# EAGLE design connection_board (EAGLE 8.6.0)
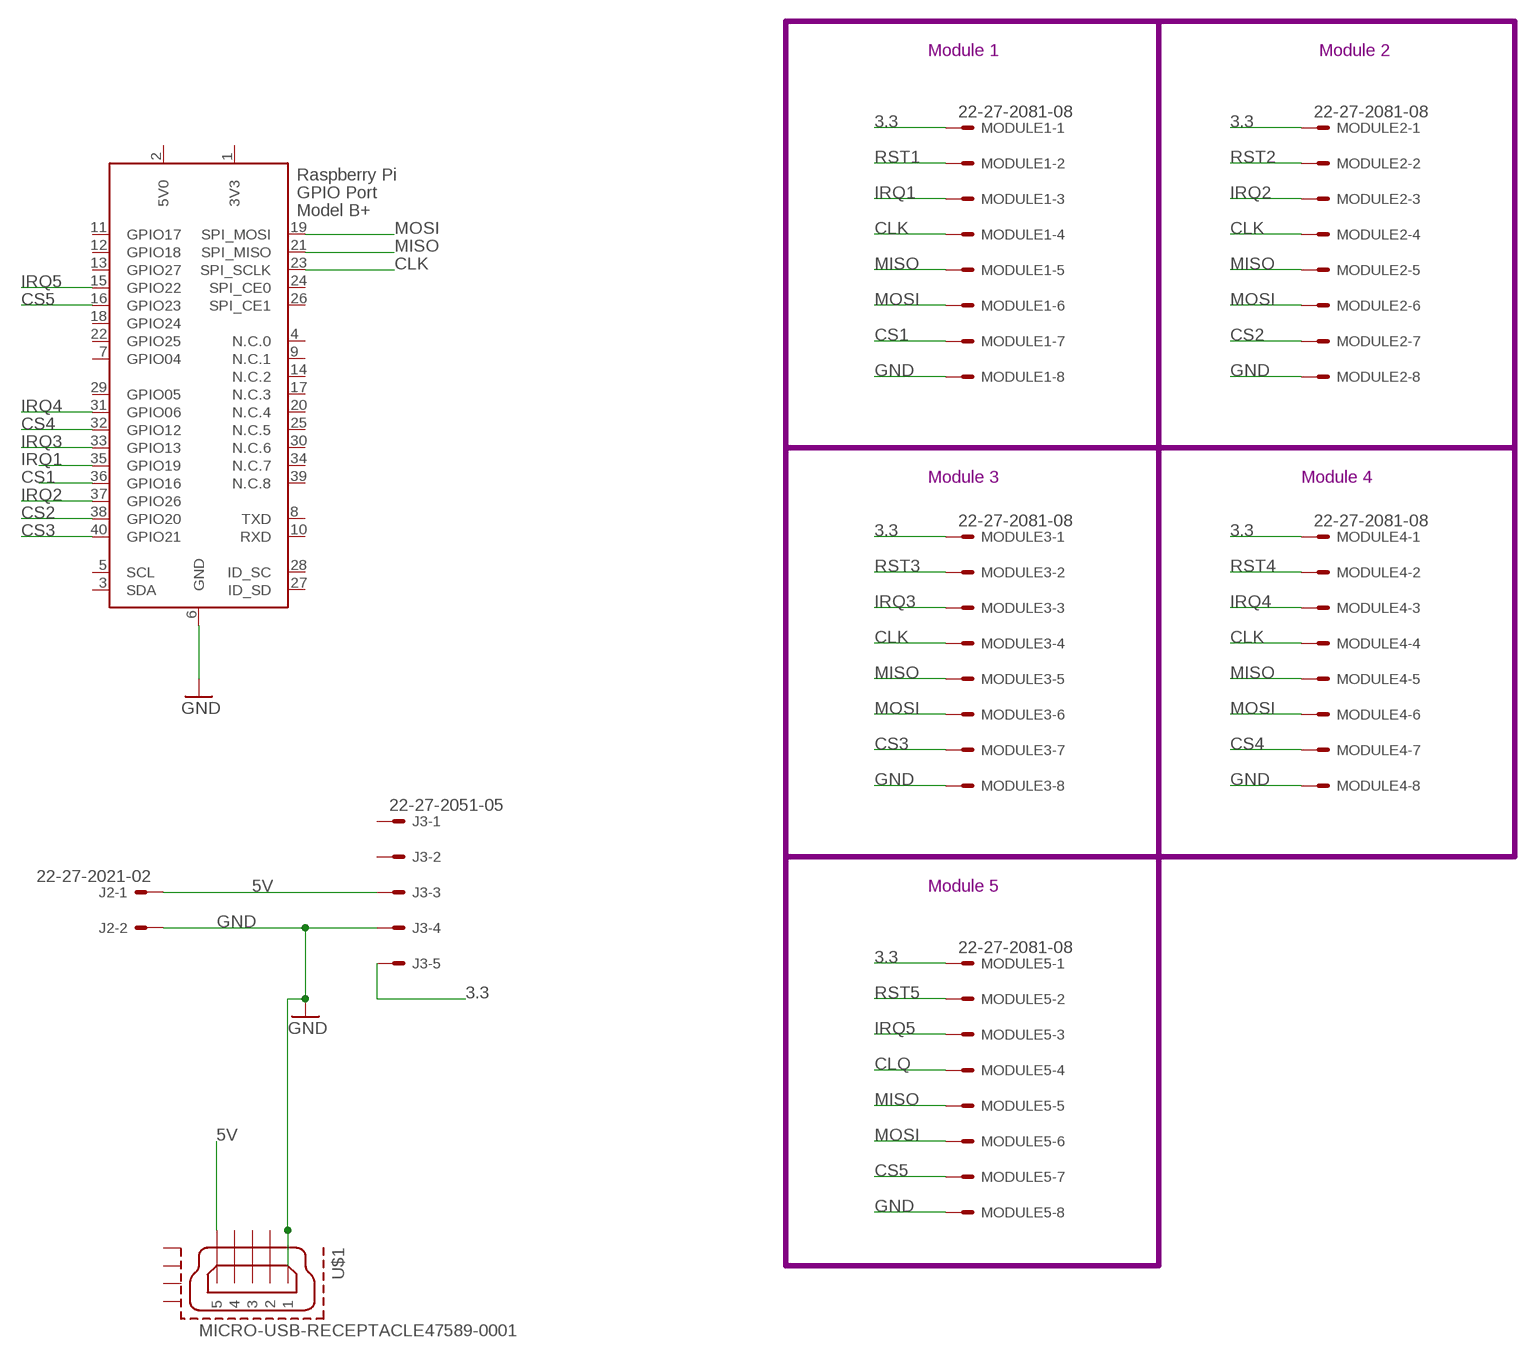
[diagram p0: schematic, sheet 1]

## Parts
J2  22-27-2021-02  [6410-02]
J3  22-27-2051-05  [6410-05]
MODULE1  22-27-2081-08  [6410-08]
MODULE2  22-27-2081-08  [6410-08]
MODULE3  22-27-2081-08  [6410-08]
MODULE4  22-27-2081-08  [6410-08]
MODULE5  22-27-2081-08  [6410-08]
U$1  MICRO-USB-RECEPTACLE47589-0001  [47589-0001]
X1  RASPI_BOARD_B+_E0  [RASPI_BOARD_B+_EDGES_0DRILL]

## Nets
3.3: J3.5 MODULE1.1 MODULE2.1 MODULE3.1 MODULE4.1 MODULE5.1
5V: J2.1 J3.3 U$1.5
CLK: MODULE1.4 MODULE2.4 MODULE3.4 MODULE4.4 X1.23(SPI_SCLK)
CLQ: MODULE5.4
CS1: MODULE1.7 X1.36(GPIO16)
CS2: MODULE2.7 X1.38(GPIO20)
CS3: MODULE3.7 X1.40(GPIO21)
CS4: MODULE4.7 X1.32(GPIO12)
CS5: MODULE5.7 X1.16(GPIO23)
GND: J2.2 J3.4 MODULE1.8 MODULE2.8 MODULE3.8 MODULE4.8 MODULE5.8 U$1.1 X1.6(GND)
IRQ1: MODULE1.3 X1.35(GPIO19)
IRQ2: MODULE2.3 X1.37(GPIO26)
IRQ3: MODULE3.3 X1.33(GPIO13)
IRQ4: MODULE4.3 X1.31(GPIO06)
IRQ5: MODULE5.3 X1.15(GPIO22)
MISO: MODULE1.5 MODULE2.5 MODULE3.5 MODULE4.5 MODULE5.5 X1.21(SPI_MISO)
MOSI: MODULE1.6 MODULE2.6 MODULE3.6 MODULE4.6 MODULE5.6 X1.19(SPI_MOSI)
RST1: MODULE1.2
RST2: MODULE2.2
RST3: MODULE3.2
RST4: MODULE4.2
RST5: MODULE5.2
Unconnected: J3.1 J3.2 U$1.2 U$1.3 U$1.4 U$1.CASING1(GND1) U$1.CASING2(GND2) U$1.CASING3(GND3) U$1.CASING4(GND4) X1.3(SDA) X1.4(N.C.0) X1.5(SCL) X1.7(GPIO04) X1.8(TXD) X1.9(N.C.1) X1.10(RXD) X1.11(GPIO17) X1.12(GPIO18) X1.13(GPIO27) X1.14(N.C.2) X1.17(N.C.3) X1.18(GPIO24) X1.20(N.C.4) X1.22(GPIO25) X1.24(SPI_CE0) X1.25(N.C.5) X1.26(SPI_CE1) X1.27(ID_SD) X1.28(ID_SC) X1.29(GPIO05) X1.30(N.C.6) X1.34(N.C.7) X1.39(N.C.8)

## Notes on the sheet
- Module 1 | Module 2
- Module 3 | Module 4
- Module 5

## Power pins joined to a net without a drawn wire
3V3: X1.1(3V3)
5V0: X1.2(5V0)

## Library data of the parts
J2 = 2pin1.15mm:22-?-02: CONNECTOR wire to board 2.54 mm (.1 inch) pitch header; MF: MOLEX; OC_FARNELL: unknown; OC_NEWARK: unknown
J3 = pin51.1mm:22-?-05: CONNECTOR wire to board 2.54 mm (.1 inch) pitch header; MF: MOLEX; OC_FARNELL: unknown; OC_NEWARK: unknown
MODULE1-MODULE5 = 8pin1.15mm:22-?-08: CONNECTOR wire to board 2.54 mm (.1 inch) pitch header; MF: MOLEX; OC_FARNELL: unknown; OC_NEWARK: unknown
U$1 = con-molex-usb:MICRO-USB-RECEPTACLE: MICRO USB RECEPTACLES Micro-USB Receptacles, SMT, Lead-Free from MOLEX <http://www.molex.com/>. (C) 2014 Tomasz Boleslaw CEDRO, cederom@tlen.pl, http://www.tomek.cedro.info. Version 0.1 (2014-01-17): Initial release. Version 0.2 (2014-02-06): Updated 47589-0001 footprint pins/pads/milling. Following devices are included: 1. 47589-0001 Micro-USB AB Receptacle, Bottom Mount, SMT, Lead-Free <http://www.molex.com/molex/products/datasheet.jsp?part=active/0475890001_IO_CONNECTORS.xml> (Technical Drawing <http://www.molex.com/pdm_docs/sd/475890001_sd.pdf>).
X1 = raspberrypi_bastelstube_v13:RASPI_BOARD_B+: Raspberry Pi GPIO connector with markings for the outer dimensions of the Raspberry Pi board model B+ with different sets of drill holes or mounting pads

## Board
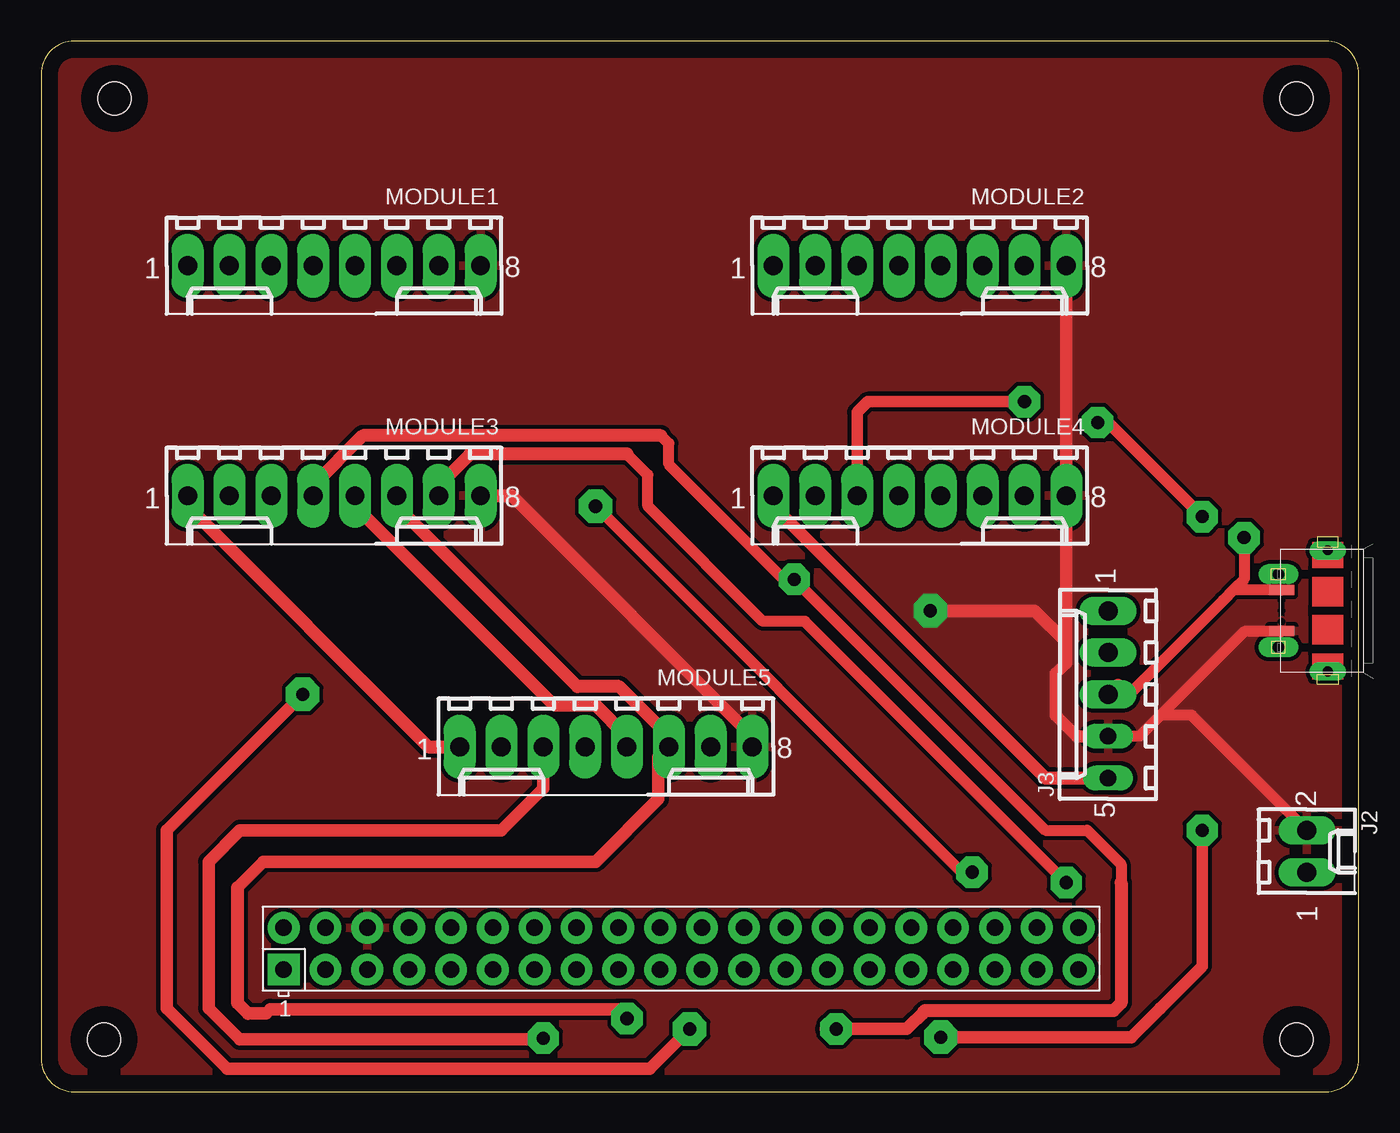
[diagram p1: board, top side]
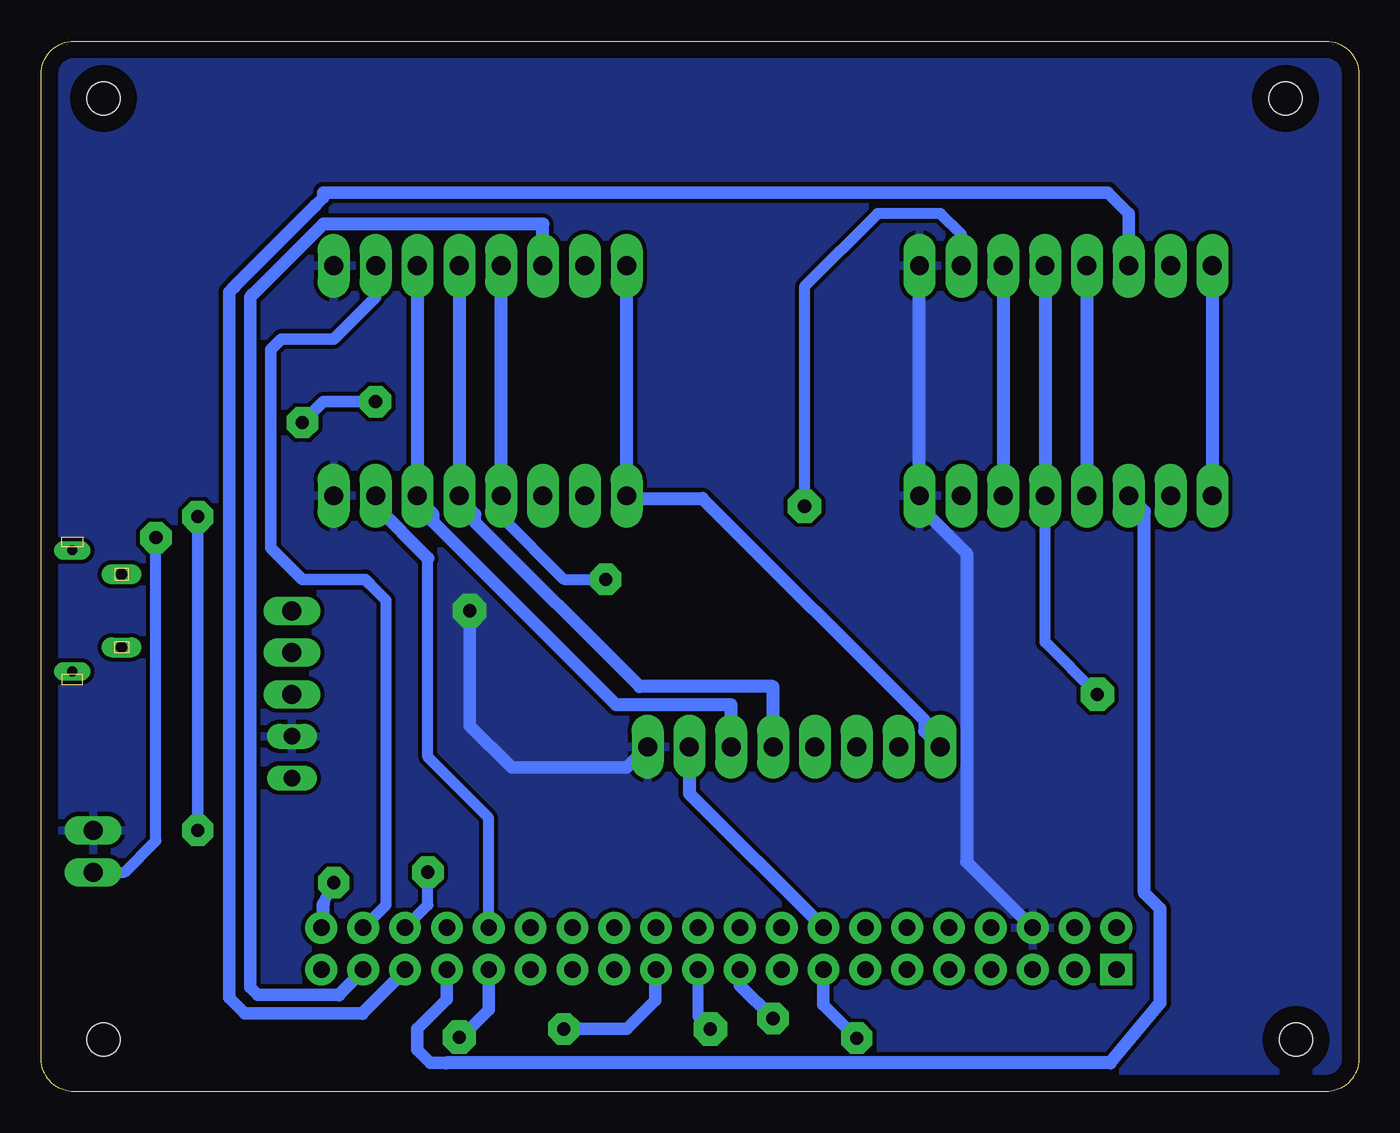
[diagram p2: board, bottom side, seen from below]

Size 79.99 x 63.8 mm. Coordinates in mm from the lower left corner, seen from the top.
Outline: 0,61.8 0,2 arc90 2,0 77.99,0 arc90 79.99,2 79.99,61.8 arc90 77.99,63.8 2,63.8 arc90 0,61.8
Copper layers (1*16): Top 0.035mm / dielectric 1.5mm / Bottom 0.035mm
Design rules "default *": minimum track width 0.8mm, minimum drill 0.8mm, track to track 0.25mm, track to pad 6mil, pad to pad 6mil, via to via 6mil, smd to smd 6mil, copper to edge 40mil, drill to drill 6mil, minimum pad ring 10mil, minimum via ring 8mil, stop-mask expansion 4mil, vias tented up to drill 0mil, thermal gap 10mil
Holes 2 mm at 3.81,3.17 76.2,3.17 76.2,60.32 4.45,60.32

### Footprints (pad centres in the part's own frame; a part is rotated, then mirrored left to right if it is on the bottom)
6410-02 = drill 1.15 long: 1 1.27,0; 2 -1.27,0
6410-05 = drill 1.15 long: 1 5.08,0; 2 2.54,0; 3 0,0 | drill 1.016 long: 4 -2.54,0; 5 -5.08,0
6410-08 = drill 1.15 pad 1.93 long: 1 8.89,0; 2 6.35,0; 3 3.81,0; 4 1.27,0; 5 -1.27,0; 6 -3.81,0; 7 -6.35,0; 8 -8.89,0
47589-0001 = smd 1.524 x 0.61: 1 2.8,1.224; 5 2.8,-1.249 | smd 0 x 0: 2 2.8,0.65; 3 2.8,0; 4 2.8,-0.65 | drill 0.6 pad 0.95 long: CASING1 0,3.675; CASING2 0,-3.675 | drill 0.7 pad 0.889 long: CASING3 3,2.225; CASING4 3,-2.225
RASPI_BOARD_B+_EDGES_0DRILL = drill 1 pad 1.93 square: 1 0.75,2.97 | drill 1 pad 1.93: 2 0.75,5.51; 3 3.29,2.97; 4 3.29,5.51; 5 5.83,2.97; 6 5.83,5.51; 7 8.37,2.97; 8 8.37,5.51; 9 10.91,2.97; 10 10.91,5.51; 11 13.45,2.97; 12 13.45,5.51; 13 15.99,2.97; 14 15.99,5.51; 15 18.53,2.97; 16 18.53,5.51; 17 21.07,2.97; 18 21.07,5.51; 19 23.61,2.97; 20 23.61,5.51; 21 26.15,2.97; 22 26.15,5.51; 23 28.69,2.97; 24 28.69,5.51; 25 31.23,2.97; 26 31.23,5.51; 27 33.77,2.97; 28 33.77,5.51; 29 36.31,2.97; 30 36.31,5.51; 31 38.85,2.97; 32 38.85,5.51; 33 41.39,2.97; 34 41.39,5.51; 35 43.93,2.97; 36 43.93,5.51; 37 46.47,2.97; 38 46.47,5.51; 39 49.01,2.97; 40 49.01,5.51

### Placement (x,y rotation side)
J2  76.83,14.61 270 top
J3  64.77,24.13 90 top
MODULE1  17.78,50.16 180 top
MODULE2  53.34,50.16 180 top
MODULE3  17.78,36.2 180 top
MODULE4  53.34,36.2 180 top
MODULE5  34.29,20.96 180 top
U$1  78.11,29.21 180 top
X1  13.97,4.45 0 top

### Tracks (layer width: path | path; a pad name or v marks a point on that pad's centre or on a via)
3.3
  Top 0.8: MODULE5.1 23.5,20.96 8.89,35.56 MODULE3.1 | J3.5 60.96,19.05 44.45,35.56 MODULE4.1
  Bottom 0.8: MODULE1.1 MODULE3.1 | MODULE2.1 MODULE4.1 44.13,36.04 39.85,36.04 26.35,22.54 26.35,21.91 MODULE5.1
5V  (via drill 0.8 pad 1.91)
  Top 0.66: 65.38,24.74 J3.3 66.04,24.13 71.75,29.85 72.37,30.46 | U$1.5 72.37,30.46 | v73.03,33.66 73.03,31.12 72.37,30.46
  Bottom 0.66: J2.1 74.93,13.33 73.03,15.24 v73.03,33.66
CLK  (via drill 0.8 pad 1.91)
  Top 0.66: 37.62,39.85 38.1,39.37 38.1,38.1 45.09,31.12 v45.72,31.12 60.96,15.88 63.5,15.88 65.56,13.81 65.56,12.7
  Top 0.762: 53.66,4.92 52.55,3.81 v48.26,3.81 47.62,3.81
  Top 0.8: 53.5,4.76 53.66,4.92 65.09,4.92 65.56,5.4 65.56,12.7 | MODULE3.4 16.51,36.83 19.53,39.85 37.62,39.85
  Bottom 0.66: MODULE4.4 52.07,34.92 48.26,31.12 v45.72,31.12
  Bottom 0.762: v48.26,3.81 44.45,3.81 42.7,5.56 42.7,7.3
  Bottom 0.8: MODULE1.4 MODULE3.4 | 52.07,34.77 MODULE4.4 MODULE2.4 | 42.7,7.3 X1.23
CS1  (via drill 0.8 pad 1.91, 0.8 pad 2.03)
  Top 0.66: v56.52,13.33 55.88,13.33 v33.66,35.56
  Bottom 0.66: MODULE1.7 24.13,52.07 25.4,53.34 29.21,53.34 33.66,48.89 v33.66,35.56 | 58.08,10.14 X1.36 56.52,11.34 v56.52,13.33
CS2
  Bottom 0.66: X1.38 59.05,11.34 59.05,29.85 60.01,30.8
  Bottom 0.711: MODULE2.7 59.69,48.26 62.23,45.72 65.41,45.72 66.04,45.09 66.04,33.02 64.14,31.12 60.33,31.12 60.01,30.8
  Bottom 0.8: 60.01,10.32 60.33,10 X1.38 | MODULE2.7 59.69,49.53
CS3  (via drill 0.8 pad 1.91)
  Top 0.66: v62.23,12.7 46.35,28.58 43.81,28.58 36.83,35.56 36.83,37.46 35.56,38.73
  Top 0.8: MODULE3.7 24.13,36.83 26.04,38.73 35.56,38.73
  Bottom 0.66: 62.87,11.43 v62.23,12.7
  Bottom 0.8: 62.87,11.43 62.87,10 X1.40
CS4
  Bottom 0.66: X1.32 52.82,16.62 56.52,20.32 56.52,32.38
  Bottom 0.8: 56.52,32.38 59.69,35.56 MODULE4.7 | 52.86,10 X1.32
CS5
  Bottom 0.8: MODULE5.7 40.64,18.1 32.54,10 X1.16
GND  (via drill 0.8 pad 2.03)
  Top 0.66: U$1.1 75.26,27.94 73.03,27.94 67.94,22.86 | 67.94,22.86 66.67,21.59 J3.4 | J2.2 69.85,22.86 67.94,22.86
  Top 0.762: MODULE2.8 MODULE4.8 62.23,27.31 | J3.4 62.87,21.59 61.59,22.86 61.59,25.4 62.23,26.04 62.23,27.31 | v53.98,29.21 60.33,29.21 62.23,27.31
  Top 0.8: MODULE5.8 43.18,21.59 28.57,36.2 MODULE3.8
  Bottom 0.762: MODULE5.8 44.45,19.69 51.44,19.69 53.98,22.23 v53.98,29.21
  Bottom 0.8: X1.6 19.84,10 23.81,13.97 23.81,32.7 26.67,35.56 MODULE3.8 MODULE1.8
  pour Top: -1.91,65.41 87.63,65.41 87.63,-2.54 -1.91,-2.54
  pour Bottom: -5.71,69.22 92.71,69.22 92.71,-8.26 -5.71,-8.26
IRQ1
  Bottom 0.762: MODULE1.3 13.97,53.34 15.24,54.61 62.87,54.61 62.87,54.29 63.34,53.82 | 60.48,4.76 67.63,4.76 68.58,5.71 68.58,48.58 68.26,48.89
  Bottom 0.8: 60.48,4.76 57.94,7.3 X1.35 | 68.26,48.89 63.34,53.82
IRQ2
  Bottom 0.762: 61.91,5.87 66.83,5.87 67.31,6.35 67.31,48.26 67.15,48.42
  Bottom 0.8: 61.91,5.87 60.48,7.3 X1.37 | 67.15,48.42 62.87,52.7 49.53,52.7 MODULE2.3
IRQ3
  Bottom 0.762: 55.4,1.75 56.36,1.75 57.15,2.54 57.15,3.81 55.36,5.6 X1.33
  Bottom 0.8: MODULE3.3 13.02,35.24 13.02,12.06 12.06,11.11 12.06,5.4 15.08,1.75 55.4,1.75 | 55.4,7.3 X1.33
IRQ4  (via drill 0.8 pad 1.91, 0.8 pad 2.03)
  Top 0.711: 67.94,5.08 70.48,7.62 v70.48,15.88 | v70.48,34.92 64.77,40.64 v64.14,40.64 | v59.69,41.91 50.16,41.91 49.53,41.27 MODULE4.3
  Top 0.762: v54.61,3.32 66.18,3.32 67.94,5.08
  Bottom 0.711: v70.48,15.88 v70.48,34.92 | v64.14,40.64 62.87,41.91 v59.69,41.91
  Bottom 0.762: X1.31 52.82,4.96 54.61,3.17 v54.61,3.32
IRQ5  (via drill 0.8 pad 1.91)
  Top 0.762: MODULE5.3 30.48,18.42 27.94,15.88 12.06,15.88 10.16,13.97 10.16,5.08 12.06,3.17 29.84,3.17 29.92,3.25 v30.48,3.25
  Bottom 0.762: v30.48,3.25 32.5,5.27 X1.15
MISO  (via drill 0.8 pad 2.03)
  Top 0.762: v39.37,3.81 36.96,1.4 11.3,1.4 7.62,5.08 7.62,15.88 v15.88,24.13
  Top 0.8: MODULE5.5 35.56,21.59 33.66,23.5 31.11,23.5 19.05,35.56 MODULE3.5
  Bottom 0.66: X1.21 40.12,4.56 v39.37,3.81 | v15.88,24.13 19.05,27.31 MODULE3.5
  Bottom 0.8: MODULE2.5 MODULE4.5 54.45,35.88 53.66,35.08 53.66,34.61 43.66,24.61 35.56,24.61 MODULE5.5 | 40.01,7.3 X1.21 | MODULE1.5 MODULE3.5
MOSI  (via drill 0.8 pad 1.91)
  Top 0.762: MODULE5.6 37.47,20.32 37.47,17.78 33.66,13.97 13.49,13.97 11.91,12.38 | v35.56,4.45 35,5.01 13.9,5.01 13.65,4.76 12.54,4.76
  Top 0.8: 12.54,4.76 11.91,5.4 11.91,12.38 | 38.1,20.32 MODULE5.6 37.94,21.27 37.94,21.75 35.08,24.61 32.54,24.61 21.59,35.56 MODULE3.6
  Bottom 0.762: X1.19 37.58,6.46 v35.56,4.45
  Bottom 0.8: MODULE2.6 MODULE4.6 56.99,35.88 56.2,35.08 56.2,34.61 45.09,23.5 38.1,23.5 MODULE5.6 | MODULE1.6 MODULE3.6 | 37.47,7.3 X1.19

### Text on the board
Document: Connector board | Module 1 | Module 2 | Module 3 | Module 4 | GND | Module 5 | RPi | Vin | Pin 1